# Altium project TS-4900 Yonder Parent.PrjPcb
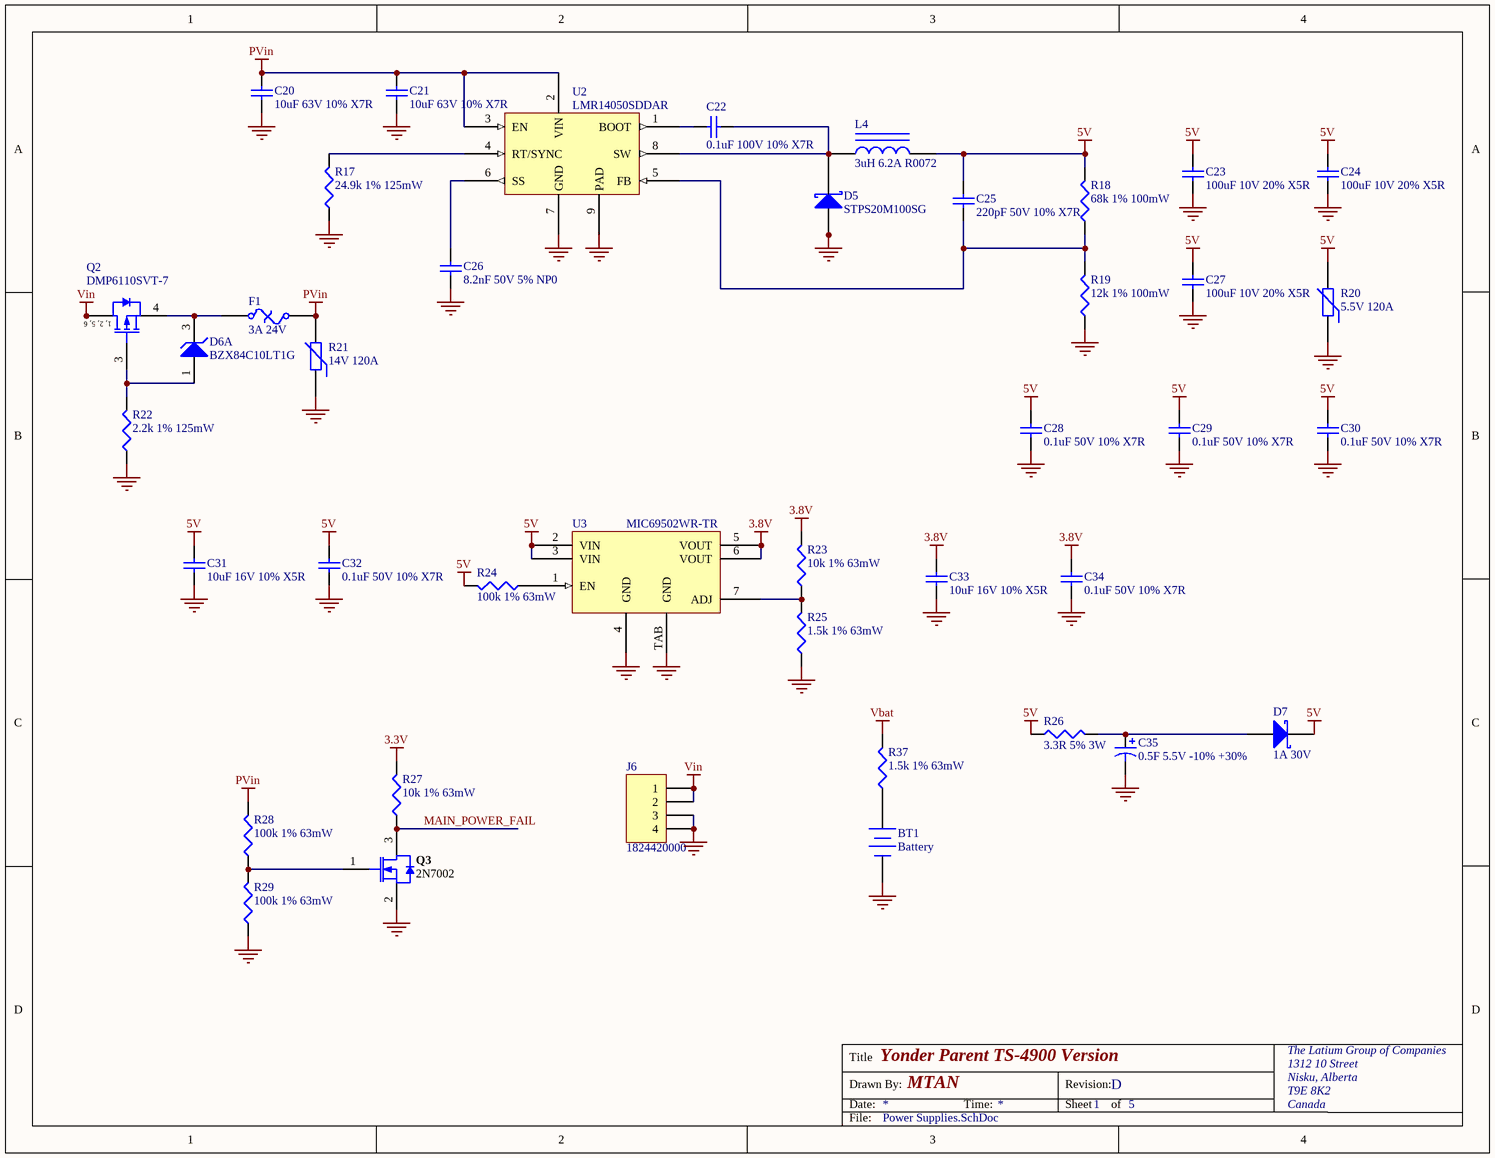
[diagram p0: Power Supplies.SchDoc]
5 sheets, 152 parts. Net scope: global (net labels, ports and power ports of the same name join across sheets).
Board file: TS-4900 Yonder Parent.PcbDoc
Sheets:
  Power Supplies.SchDoc
  PCIe Cell Modem.SchDoc
  LoRa Concentrator.SchDoc
  TS-4900 Headers.SchDoc
  External ADC and Reference.SchDoc

## Sheet Power Supplies.SchDoc: Yonder Parent TS-4900 Version
size Letter; DrawnBy: MTAN; Organization: Altium Limited; DocumentNumber: 1; Revision: D; SheetNumber: 1; SheetTotal: 5

### Parts
BT1  Battery  [MPD BS-7]
C20  10uF 63V 10% X7R  [C1210_L]
C21  10uF 63V 10% X7R  [C1210_L]
C22  0.1uF 100V 10% X7R  [C0805]
C23  100uF 10V 20% X5R  [C1210_L]
C24  100uF 10V 20% X5R  [C1210_L]
C25  220pF 50V 10% X7R  [1608[0603]]
C26  8.2nF 50V 5% NP0  [1608[0603]]
C27  100uF 10V 20% X5R  [C1210_L]
C28  0.1uF 50V 10% X7R  [CAPC1005L]
C29  0.1uF 50V 10% X7R  [CAPC1005L]
C30  0.1uF 50V 10% X7R  [CAPC1005L]
C31  10uF 16V 10% X5R  [C0805]
C32  0.1uF 50V 10% X7R  [CAPC1005L]
C33  10uF 16V 10% X5R  [C0805]
C34  0.1uF 50V 10% X7R  [CAPC1005L]
C35  0.5F 5.5V -10% +30%  [Illinois SuperCap]
D5  STPS20M100SG  [ONSC-D2PAK-3-418AJ_A_V]
D6  BZX84C10LT1G  [SOT23-3_L]  (part A of 2)
D7  1A 30V  [SOD323]
F1  3A 24V  [2920]
J6  1824420000  [1824420000]
L4  3uH 6.2A R0072  [SRU1048]
Q2  DMP6110SVT-7  [SOT23-6_L]
Q3  2N7002  [INF-PG-SOT23_L]
R17  24.9k 1% 125mW  [6-0805_L]
R18  68k 1% 100mW  [J1-0603]
R19  12k 1% 100mW  [J1-0603]
R20  5.5V 120A  [6-0805_L]
R21  14V 120A  [6-0805_L]
R22  2.2k 1% 125mW  [6-0805_L]
R23  10k 1% 63mW  [RESC1005L]
R24  100k 1% 63mW  [RESC1005L]
R25  1.5k 1% 63mW  [RESC1005L]
R26  3.3R 5% 3W  [RESC6432AL]
R27  10k 1% 63mW  [RESC1005L]
R28  100k 1% 63mW  [RESC1005L]
R29  100k 1% 63mW  [RESC1005L]
R37  1.5k 1% 63mW  [RESC1005L]
U2  LMR14050SDDAR  [MRA08A_L]
U3  MIC69502WR-TR  [SPak-7]

### Nets
3.3V: R27.2
3.8V: C33.1 C34.1 R23.2 U3.5(VOUT) U3.6(VOUT)
5V: C23.2 C24.2 C25.2 C27.2 C28.1 C29.1 C30.1 C31.1 C32.1 D7.1(K) L4.2 R18.2 R20.2 R24.2 R26.1 U3.2(VIN) U3.3(VIN)
GND: BT1.2(-) C20.1 C21.1 C23.1 C24.1 C26.1 C27.1 C28.2 C29.2 C30.2 C31.2 C32.2 C33.2 C34.2 C35.2 D5.1(A) D5.3(A) J6.3 J6.4 Q3.2(SOURCE) R17.1 R19.1 R20.1 R21.1 R22.1 R25.1 R29.1 U2.7(GND) U2.9(PAD) U3.4(GND) U3.TAB(GND)
PVin: C20.2 C21.2 F1.2 R21.2 R28.2 U2.2(VIN) U2.3(EN)
Vbat: R37.2
Vin: J6.1 J6.2 Q2.1(D) Q2.2(D) Q2.5(D) Q2.6(D)
MAIN_POWER_FAIL: Q3.3(DRAIN) R27.1
NetBT1_1: BT1.1(+) R37.1
NetC22_1: C22.1 D5.4(K) L4.1 U2.8(SW)
NetC22_2: C22.2 U2.1(BOOT)
NetC25_1: C25.1 R18.1 R19.2 U2.5(FB)
NetC26_2: C26.2 U2.6(SS)
NetC35_1: C35.1 D7.2(A) R26.2
NetD6_1: D6.1(A) Q2.3(G) R22.2
NetD6_3: D6.3(K) F1.1 Q2.4(S)
NetQ3_1: Q3.1(GATE) R28.1 R29.2
NetR17_2: R17.2 U2.4(RT/SYNC)
NetR23_1: R23.1 R25.2 U3.7(ADJ)
NetR24_1: R24.1 U3.1(EN)

### Notes on the sheet
- Title
- Drawn By:
- Date:
- Time:
- Revision:
- Sheet
- of
- The Latium Group of Companies
- 1312 10 Street
- Nisku, Alberta
- T9E 8K2
- Canada
- File:
- (in symbol NTGS3136PT1G) 1, 2, 5, 6

### Library data of the parts
BT1 = Battery: BATTERY HOLDER COIN 20MM PC PIN; Manufacturer: MPD (Memory Protection Devices); Manufacturer Part Number: BS-7; Value: CR2032 Coin Cell Holder; Supplier 1: Digi-Key; Supplier 1 Part Number: BS-7-ND
C20-C34 = Cap: Capacitor
  C20 C21: Value: 10uF 63V 10% X7R
  C22: Value: 0.1uF 100V 10% X7R
  C23 C24 C27: Value: 100uF 10V 20% X5R
  C25: Value: 220pF 50V 10% X7R
  C26: Value: 8.2nF 50V 5% NP0
  C28-C30 C32 C34: Value: 0.1uF 50V 10% X7R
  C31 C33: Value: 10uF 16V 10% X5R
C35 = Cap Pol1: CAP 500MF -10% +30% 5.5V TH; Manufacturer: Illinois Capacitor; Manufacturer Part Number: DGH504Q5R5; ComponentLink1Descrption: Data Sheet; Value: 0.5F 5.5V -10% +30%; Supplier 1: Digi-Key; Supplier 1 Part Number: 1572-1776-ND; ComponentLink1URL: S:\Hardware\Data Sheets\Passive\Capacitors\DGH series.pdf
D5 = BAS70: DIODE SCHOTTKY 100V 20A D2PAK; Manufacturer: STMicroelectronics; ComponentLink2Description: Datasheet; ComponentLink2URL: S:\Hardware\Data Sheets\Passive\Diodes\STPS20M100.pdf; Value: STPS20M100SG; Manufacturer Part Number: STPS20M100SG; Supplier 1: Digi-Key; Supplier 1 Part Number: 497-10993-1-ND
D6 = BZX84C10LT1G: DIODE ZENER 10V 225MW SOT23-3; Manufacturer: On Semiconductor; Supplier 1: Digi-Key; Supplier 1 Part Number: BZX84C10LT1GOSCT-ND; ComponentLink1Description: Data Sheet; ComponentLink1URL: S:\Hardware\Data Sheets\Passive\Diodes\BZX84C2V4LT1-D.pdf; Value: BZX84C10LT1G; Manufacturer Part Number: BZX84C10LT1G
D7 = D Schottky: Schottky Diode; Manufacturer: Toshiba Semiconductor and Storage; Manufacturer Part Number: CUS10S30,H3F; Value: 1A 30V; Supplier 1: Digi-Key; Supplier 1 Part Number: CUS10S30H3FCT-ND
F1 = Fuse Thermal: Thermal Fuse; Manufacturer Part Number: SMDC300F/24-2; Manufacturer: Littelfuse Inc; Value: 3A 24V; Supplier 1: Digi-Key; Supplier 1 Part Number: SMDC300F/24-2CT-ND
J6 = Header 4H: TERM BLK 2POS SIDE ENT 3.5MM PCB; Manufacturer: Weidmuller; Value: 1824420000; Manufacturer Part Number: 1824420000; Supplier 1: Digi-Key; Supplier 1 Part Number: 281-2020-ND
L4 = Inductor Iron: FIXED IND 3UH 6.2A 7.2 MOHM SMD; Manufacturer Part Number: SRU1048-3R0Y; Manufacturer: Bourns Inc; Value: 3uH 6.2A R0072; Supplier 1: Digi-Key; Supplier 1 Part Number: SRU1048-3R0YCT-ND; ComponentLink1Description: Data Sheet; ComponentLink1URL: S:\Hardware\Data Sheets\Passive\Inductors\SRU1048.pdf
Q2 = NTGS3136PT1G: MOSFET P-CH 60V TSOT26; Manufacturer: Diodes Incorporated; ComponentLink1Description: Data Sheet; ComponentLink1URL: S:\Hardware\Data Sheets\Passive\FETs\DMP6110SVT.pdf; Value: DMP6110SVT-7; Manufacturer Part Number: DMP6110SVT-7; Supplier 1: Digi-Key; Supplier 1 Part Number: DMP6110SVT-7DICT-ND
Q3 = 2N7002: MOSFET N-CH 60V 115MA SOT-23; Manufacturer: ON Semiconductor; PartNumber: 2N7002; ComponentLink1Description: Data Sheet; ComponentLink1URL: S:\Hardware\Data Sheets\Active\Transistors\FETs\NDS7002A-D.pdf; Manufacturer Part Number: 2N7002; Value: 2N7002; Supplier 1: Digi-Key; Supplier 1 Part Number: 2N7002NCT-ND
R17-R19 R22-R25 R27-R29 R37 = Res3: Resistor
  R17: Value: 24.9k 1% 125mW
  R18: Value: 68k 1% 100mW
  R19: Value: 12k 1% 100mW
  R22: Value: 2.2k 1% 125mW
  R23 R27: Value: 10k 1% 63mW
  R24 R28 R29: Value: 100k 1% 63mW
  R25 R37: Value: 1.5k 1% 63mW
R20 = Res Varistor: VARISTOR 8.2V 120A 0805; Manufacturer: Littelfuse Inc; Manufacturer Part Number: V5.5MLA0805H; Value: 5.5V 120A; Supplier 1: Digi-Key; Supplier 1 Part Number: F2215CT-ND
R21 = Res Varistor: VARISTOR 18.1V 120A 0805; Manufacturer: Littelfuse Inc; Manufacturer Part Number: V14MLA0805NH; Value: 14V 120A; Supplier 1: Digi-Key; Supplier 1 Part Number: F3734CT-ND
R26 = Res3: RES SMD 3.3 OHM 5% 3W 2512; Manufacturer: TE Connectivity Passive Product; Manufacturer Part Number: 35223R3JT; Value: 3.3R 5% 3W; Supplier 1: Digi-Key; Supplier 1 Part Number: A121247CT-ND
U2 = LMR14050: IC REG BUCK ADJUSTABLE 5A 8SOPWR; Manufacturer: Texas Instruments; Value: LMR14050SDDAR; Manufacturer Part Number: LMR14050SDDAR; Supplier 1: Digi-Key; Supplier 1 Part Number: 296-44322-1-ND; ComponentLink1Description: Data Sheet; ComponentLink1URL: S:\Hardware\Data Sheets\Active\Voltage Regulators\lmr14050.pdf
U3 = MIC69502: IC REG LINEAR POS ADJ 5A SPAK-7; Manufacturer: Microchip Technology; Value: MIC69502WR-TR; Manufacturer Part Number: MIC69502WR-TR; Supplier 1: Digi-Key; Supplier 1 Part Number: MIC69502WR-CT-ND; ComponentLink1Description: Data Sheet; ComponentLink1URL: S:\Hardware\Data Sheets\Active\Voltage Regulators\mic69502.pdf

## Sheet PCIe Cell Modem.SchDoc: Yonder Parent TS-4900 Version
size Letter; DrawnBy: MTAN; Organization: Altium Limited; DocumentNumber: 2; Revision: D; SheetNumber: 2; SheetTotal: 5
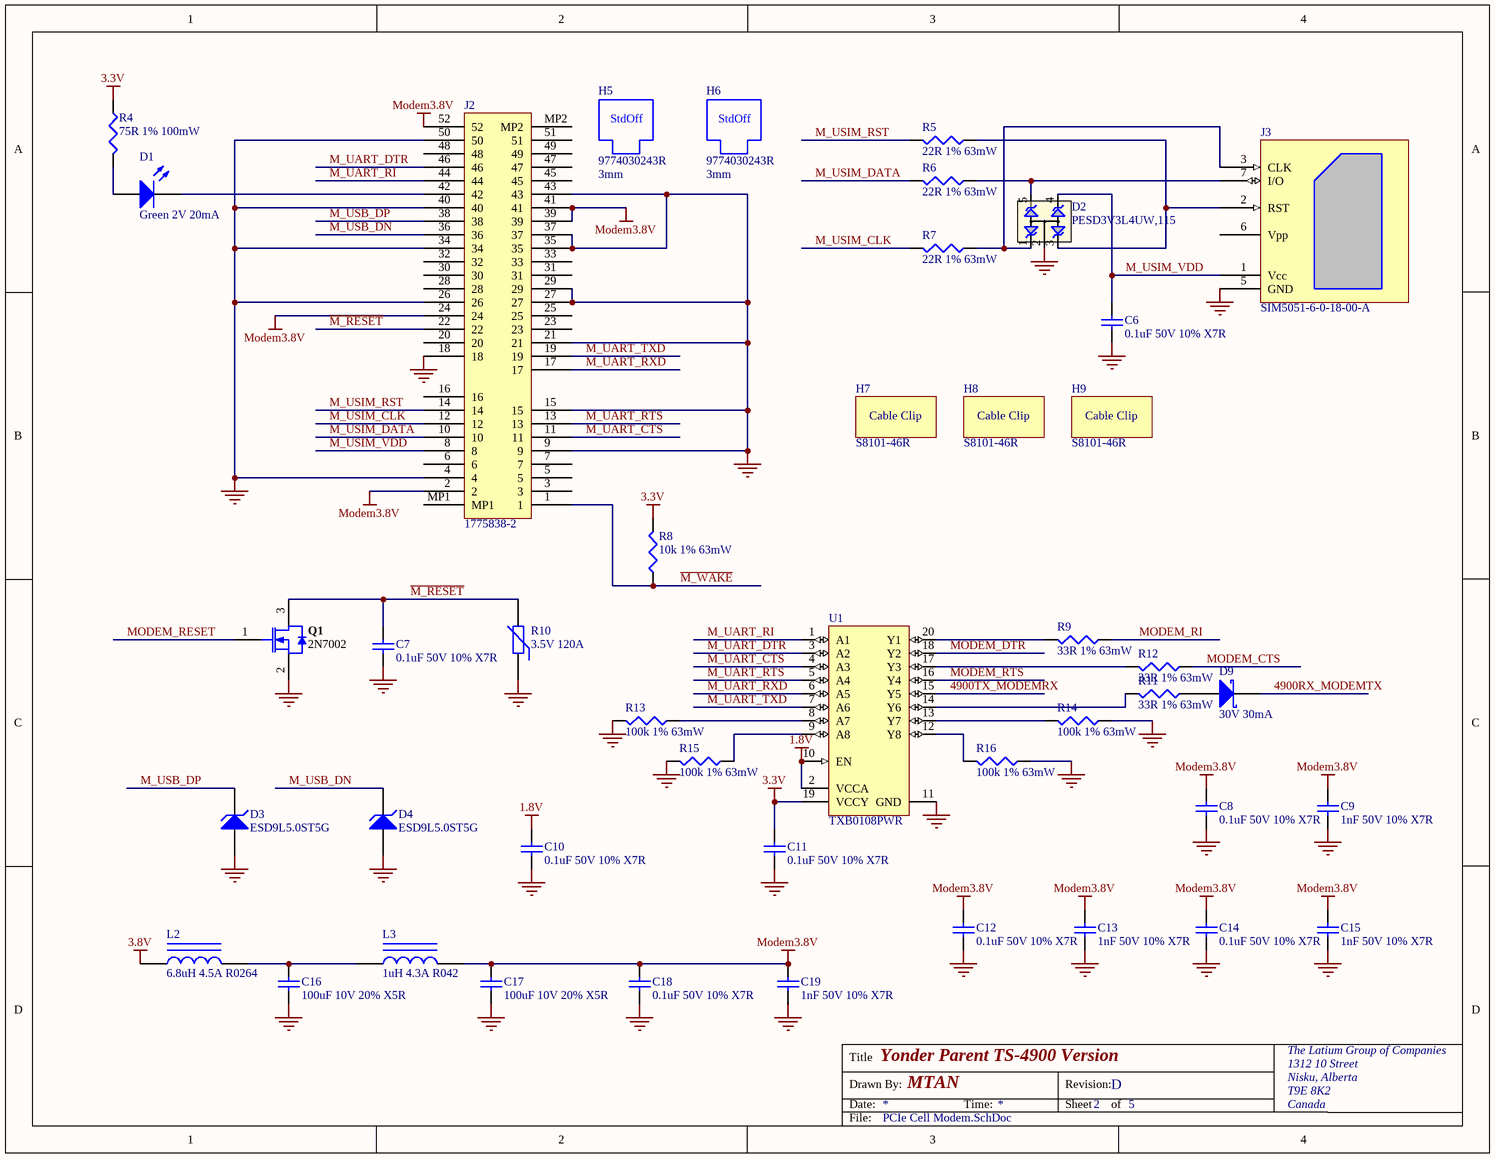
[diagram p1: PCIe Cell Modem.SchDoc]

### Parts
C6  0.1uF 50V 10% X7R  [CAPC1005L]
C7  0.1uF 50V 10% X7R  [CAPC1005L]
C8  0.1uF 50V 10% X7R  [CAPC1005L]
C9  1nF 50V 10% X7R  [CAPC1005L]
C10  0.1uF 50V 10% X7R  [CAPC1005L]
C11  0.1uF 50V 10% X7R  [CAPC1005L]
C12  0.1uF 50V 10% X7R  [CAPC1005L]
C13  1nF 50V 10% X7R  [CAPC1005L]
C14  0.1uF 50V 10% X7R  [CAPC1005L]
C15  1nF 50V 10% X7R  [CAPC1005L]
C16  100uF 10V 20% X5R  [C1210_L]
C17  100uF 10V 20% X5R  [C1210_L]
C18  0.1uF 50V 10% X7R  [CAPC1005L]
C19  1nF 50V 10% X7R  [CAPC1005L]
D1  Green 2V 20mA  [CD1608-0603]
D2  PESD3V3L4UW,115  [SOT-665]
D3  ESD9L5.0ST5G  [SOD-923]
D4  ESD9L5.0ST5G  [SOD-923]
D9  30V 30mA  [CD1310-0504]
H5  9774030243R  Height: 3mm  [Wurth 9774030243R]
H6  9774030243R  Height: 3mm  [Wurth 9774030243R]
H7  S8101-46R  [Coax Cable Clip]
H8  S8101-46R  [Coax Cable Clip]
H9  S8101-46R  [Coax Cable Clip]
J2  1775838-2  [TE 1775838-2]
J3  SIM5051-6-0-18-00-A  [SIM5051-6]
L2  6.8uH 4.5A R0264  [1267AY]
L3  1uH 4.3A R042  [WE-LQS 252012]
Q1  2N7002  [INF-PG-SOT23_L]
R4  75R 1% 100mW  [RESC1608L]
R5  22R 1% 63mW  [RESC1005L]
R6  22R 1% 63mW  [RESC1005L]
R7  22R 1% 63mW  [RESC1005L]
R8  10k 1% 63mW  [RESC1005L]
R9  33R 1% 63mW  [RESC1005L]
R10  3.5V 120A  [6-0805_L]
R11  33R 1% 63mW  [RESC1005L]
R12  33R 1% 63mW  [RESC1005L]
R13  100k 1% 63mW  [RESC1005L]
R14  100k 1% 63mW  [RESC1005L]
R15  100k 1% 63mW  [RESC1005L]
R16  100k 1% 63mW  [RESC1005L]
U1  TXB0108PWR  [TSSOP20_L]

### Nets
1.8V: C10.1 U1.2(VCCA) U1.10(EN)
3.3V: C11.1 R4.1 R8.2 U1.19(VCCY)
3.8V: L2.1
GND: C6.2 C7.2 C8.2 C9.2 C10.2 C11.2 C12.2 C13.2 C14.2 C15.2 C16.1 C17.1 C18.2 C19.2 D2.2(A1) D3.1(A) D4.1(A) J2.4 J2.9 J2.15 J2.18 J2.21 J2.26 J2.27 J2.29 J2.34 J2.35 J2.37 J2.40 J2.43 J2.50 J3.5(GND) Q1.2(SOURCE) R10.1 R13.2 R14.1 R15.2 R16.1 U1.11(GND)
Modem3.8V: C8.1 C9.1 C12.1 C13.1 C14.1 C15.1 C17.2 C18.1 C19.1 J2.2 J2.24 J2.39 J2.41 J2.52 L3.2
4900RX_MODEMTX: D9.2(K)
4900TX_MODEMRX: U1.15(Y5)
~{M_RESET}: C7.1 J2.22 Q1.3(DRAIN) R10.2
~{M_WAKE}: J2.1 R8.1
M_UART_CTS: J2.11 U1.4(A3)
M_UART_DTR: J2.46 U1.3(A2)
M_UART_RI: J2.44 U1.1(A1)
M_UART_RTS: J2.13 U1.5(A4)
M_UART_RXD: J2.17 U1.6(A5)
M_UART_TXD: J2.19 U1.7(A6)
M_USB_DN: D4.2(K) J2.36
M_USB_DP: D3.2(K) J2.38
M_USIM_CLK: J2.12 R7.2
M_USIM_DATA: J2.10 R6.2
M_USIM_RST: J2.14 R5.2
M_USIM_VDD: C6.1 D2.4(C3) J2.8 J3.1(Vcc)
MODEM_CTS: R12.1
MODEM_DTR: U1.18(Y2)
MODEM_RESET: Q1.1(GATE)
MODEM_RI: R9.1
MODEM_RTS: U1.16(Y4)
NetC16_2: C16.2 L2.2 L3.1
NetD1_1: D1.1(A) R4.2
NetD1_2: D1.2(K) J2.42
NetD2_1: D2.1(C1) J3.3(CLK) R7.1
NetD2_3: D2.3(C2) J3.2(RST) R5.1
NetD2_5: D2.5(C4) J3.7(I/O) R6.1
NetD9_1: D9.1(A) R11.1
NetR9_2: R9.2 U1.20(Y1)
NetR11_2: R11.2 U1.14(Y6)
NetR12_2: R12.2 U1.17(Y3)
NetR13_1: R13.1 U1.8(A7)
NetR14_2: R14.2 U1.13(Y7)
NetR15_1: R15.1 U1.9(A8)
NetR16_2: R16.2 U1.12(Y8)

Not connected (* = marked no-connect by the designer): J2 3 5 6 7 16 20 23 25 28 30 31 32 33 45 47 48 49 51 MP1 MP2; J3 6(Vpp)

### Notes on the sheet
- Title
- Drawn By:
- Date:
- Time:
- Revision:
- Sheet
- of
- The Latium Group of Companies
- 1312 10 Street
- Nisku, Alberta
- T9E 8K2
- Canada
- File:
- (in symbol SMD M3 Spacer) StdOff

### Library data of the parts
C6-C19 = Cap: Capacitor
  C6-C8 C10-C12 C14 C18: Value: 0.1uF 50V 10% X7R
  C9 C13 C15 C19: Value: 1nF 50V 10% X7R
  C16 C17: Value: 100uF 10V 20% X5R
D1 = LED2: LED GREEN CLEAR 0603 SMD; Manufacturer: Wurth Electronics Inc; Manufacturer Part Number: 150060VS75000; Value: Green 2V 20mA; Supplier 1: Digi-Key; Supplier 1 Part Number: 732-4980-1-ND
D2 = 82402374: TVS DIODE 3.3V 12V SOT665; Manufacturer: Nexperia USA Inc; Value: PESD3V3L4UW,115; Manufacturer Part Number: PESD3V3L4UW,115; Supplier 1: Digi-Key; Supplier 1 Part Number: 1727-5790-1-ND; ComponentLink1Description: Data Sheet; ComponentLink1URL: S:\Hardware\Data Sheets\Passive\TVS\PESDXL4UF_G_W.pdf
D3 D4 = D Zener: TVS DIODE 5V 9.8V SOD923; Manufacturer: ON Semiconductor; Value: ESD9L5.0ST5G; Manufacturer Part Number: ESD9L5.0ST5G; Supplier 1: Digi-Key; Supplier 1 Part Number: ESD9L5.0ST5GOSCT-ND
D9 = D Schottky: DIODE SCHOTTKY 30V 30MA SOD523; Manufacturer: ON Semiconductor; Manufacturer Part Number: RB751S40T1G; Value: 30V 30mA; Supplier 1: Digi-Key; Supplier 1 Part Number: RB751S40T1GOSCT-ND
H5 H6 = SMD M3 Spacer: ROUND STANDOFF M2X0.4 STEEL 3MM; Manufacturer: Wurth Electronics Inc; Supplier 1: Digi-Key; Value: 9774030243R; Manufacturer Part Number: 9774030243R; ComponentLink1Description: Drawing; ComponentLink1URL: S:\Hardware\Data Sheets\Passive\Standoffs\Wurth 9774070360R.pdf; Supplier 1 Part Number: 732-7085-1-ND
H7-H9 = Cable Clip: CBL CLIP C-TYPE SILVER SOLDER; Manufacturer: Harwin Inc; Value: S8101-46R; ComponentLink1Description: Drawing; ComponentLink1URL: S:\Hardware\Data Sheets\Passive\Strain Reliefs\S8101R.pdf; Manufacturer Part Number: S8101-46R; Supplier 1: Digi-Key; Supplier 1 Part Number: 952-1576-1-ND
J2 = TE1775838-2: CONN PCI EXP MINI FEMALE 52POS; Manufacturer: TE Connectivity AMP Connectors; Value: 1775838-2; Manufacturer Part Number: 1775838-2; ComponentLink1Description: Data Sheet; ComponentLink1URL: S:\Hardware\Data Sheets\Passive\Connectors\TE Mini PCIe 52 Pin Connector.pdf; Supplier 1: Digi-Key; Supplier 1 Part Number: A123340CT-ND; ComponentLink2Description: SIM7600 PCIe HW Design Guide; ComponentLink2URL: S:\Hardware\Data Sheets\Active\Modems\SIM7600 PCIe Hardware Design Guide.pdf
J3 = Mini SIM 6pos Conn: MINI SIM HINGED, 6P, SMT, 1.8MM; Manufacturer: GCT; Value: SIM5051-6-0-18-00-A; Manufacturer Part Number: SIM5051-6-0-18-00-A; Supplier 1: Digi-Key; Supplier 1 Part Number: 2073-SIM5051-6-0-18-00-ACT-ND; ComponentLink1Description: Data Sheet; ComponentLink1URL: S:\Hardware\Data Sheets\Passive\Connectors\sim5051.pdf
L2 = Inductor Iron: 6.8µH Shielded Fixed Inductor; Manufacturer Part Number: 1267AY-6R8N=P3; Manufacturer: Murata Electronics; Value: 6.8uH 4.5A R0264; Supplier 1: Digi-Key; Supplier 1 Part Number: 490-14066-1-ND
L3 = Inductor Iron: FIXED IND 1UH 4.3A 42 MOHM SMD; Manufacturer Part Number: DFE252012P-1R0M=P2; Manufacturer: Murata Electronics; Value: 1uH 4.3A R042; Supplier 1: Digi-Key; Supplier 1 Part Number: 490-10647-1-ND
Q1 = 2N7002: as Q3 on sheet Power Supplies; PartNumber: 2N7002; ComponentLink1Description: Data Sheet; ComponentLink1URL: S:\Hardware\Data Sheets\Active\Transistors\FETs\NDS7002A-D.pdf; Manufacturer Part Number: 2N7002; Value: 2N7002; Supplier 1: Digi-Key; Supplier 1 Part Number: 2N7002NCT-ND
R4-R9 R11-R16 = Res3: Resistor
  R4: Value: 75R 1% 100mW
  R5-R7: Value: 22R 1% 63mW
  R8: Value: 10k 1% 63mW
  R9 R11 R12: Value: 33R 1% 63mW
  R13-R16: Value: 100k 1% 63mW
R10 = Res Varistor: VARISTOR 5.35V 120A 0805; Manufacturer: Littelfuse Inc; Manufacturer Part Number: V3.5MLA0805H; Value: 3.5V 120A; Supplier 1: Digi-Key; Supplier 1 Part Number: F2206CT-ND
U1 = ADG3300BRUZ: IC TRNSLTR BIDIRECTIONAL 20TSSOP; Manufacturer: Texas Instruments; Value: TXB0108PWR; Manufacturer Part Number: TXB0108PWR; Supplier 1: Digi-Key; Supplier 1 Part Number: 296-21527-1-ND; ComponentLink1Description: Data Sheet; ComponentLink1URL: S:\Hardware\Data Sheets\Active\Logic\txb0108.pdf

## Sheet LoRa Concentrator.SchDoc: Yonder Parent TS-4900 Version
size Letter; DrawnBy: MTAN; Organization: Altium Limited; DocumentNumber: 3; Revision: D; SheetNumber: 3; SheetTotal: 5
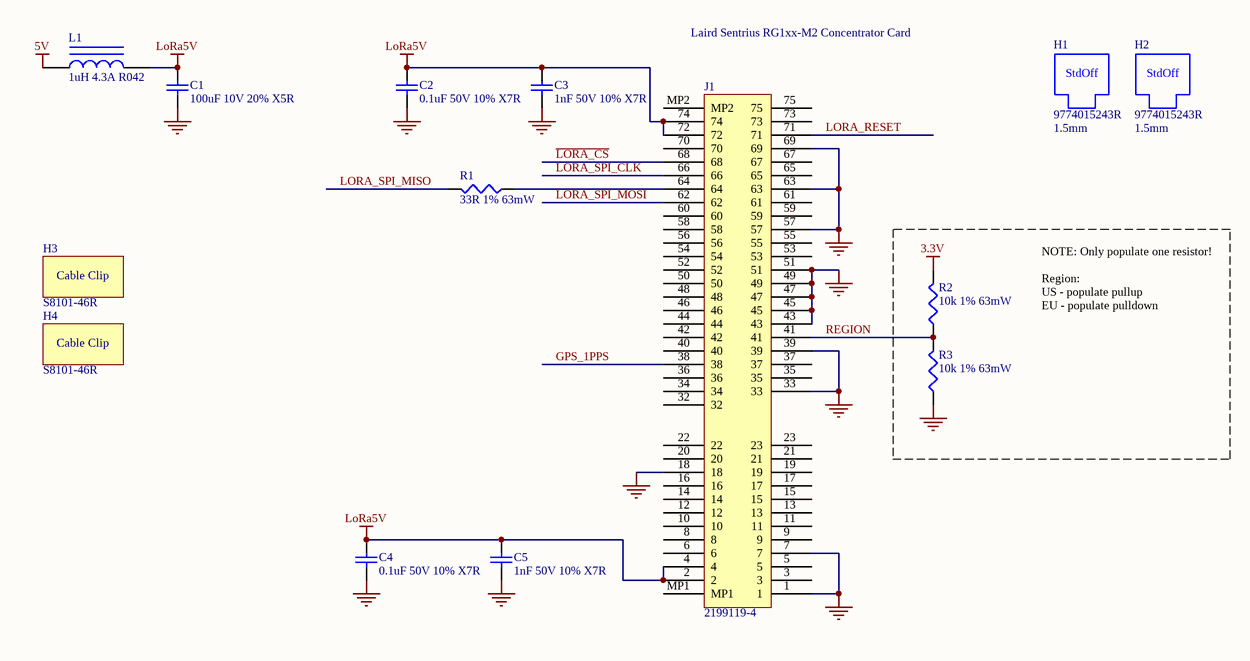
[diagram p2: LoRa Concentrator.SchDoc]

### Parts
C1  100uF 10V 20% X5R  [C1210_L]
C2  0.1uF 50V 10% X7R  [CAPC1005L]
C3  1nF 50V 10% X7R  [CAPC1005L]
C4  0.1uF 50V 10% X7R  [CAPC1005L]
C5  1nF 50V 10% X7R  [CAPC1005L]
H1  9774015243R  Height: 1.5mm  [Wurth 9774015243R]
H2  9774015243R  Height: 1.5mm  [Wurth 9774015243R]
H3  S8101-46R  [Coax Cable Clip]
H4  S8101-46R  [Coax Cable Clip]
J1  2199119-4  [TE 2199119-4]
L1  1uH 4.3A R042  [WE-LQS 252012]
R1  33R 1% 63mW  [RESC1005L]
R2  10k 1% 63mW  [RESC1005L]
R3  10k 1% 63mW  [RESC1005L]

### Nets
3.3V: R2.2
5V: L1.1
GND: C1.1 C2.2 C3.2 C4.2 C5.2 J1.1 J1.7 J1.18 J1.33 J1.39 J1.43 J1.45 J1.47 J1.49 J1.51 J1.57 J1.63 J1.69 R3.1
LoRa5V: C1.2 C2.1 C3.1 C4.1 C5.1 J1.2 J1.4 J1.72 J1.74 L1.2
GPS_1PPS: J1.38
~{LORA_CS}: J1.68
LORA_RESET: J1.71
LORA_SPI_CLK: J1.66
LORA_SPI_MISO: R1.2
LORA_SPI_MOSI: J1.62
REGION: J1.41 R2.1 R3.2
NetJ1_64: J1.64 R1.1

Not connected (* = marked no-connect by the designer): J1 3 5 6 8 9 10 11 12 13 14 15 16 17 19 20 21 22 23 32 34 35 36 37 40 42 44 46 48 50 52 53 54 55 56 58 59 60 61 65 67 70 73 75 MP1 MP2

### Notes on the sheet
- Laird Sentrius RG1xx-M2 Concentrator Card
- NOTE: Only populate one resistor!
  Region:
  US - populate pullup
  EU - populate pulldown
- Title
- Drawn By:
- Date:
- Time:
- Revision:
- Sheet
- of
- The Latium Group of Companies
- 1312 10 Street
- Nisku, Alberta
- T9E 8K2
- Canada
- File:
- (in symbol SMD 1.5mm Spacer) StdOff

### Library data of the parts
C1-C5 = Cap: Capacitor
  C1: Value: 100uF 10V 20% X5R
  C2 C4: Value: 0.1uF 50V 10% X7R
  C3 C5: Value: 1nF 50V 10% X7R
H1 H2 = SMD 1.5mm Spacer: RND STANDOFF M2X0.4 STEEL; Manufacturer: Wurth Electronics Inc; Supplier 1: Digi-Key; Value: 9774015243R; Manufacturer Part Number: 9774015243R; Supplier 1 Part Number: 732-7069-1-ND; ComponentLink1Description: Drawing; ComponentLink1URL: S:\Hardware\Data Sheets\Passive\Standoffs\Wurth 9774015243R.pdf
H3 H4 = Cable Clip: as H7 on sheet PCIe Cell Modem; Value: S8101-46R; ComponentLink1Description: Drawing; ComponentLink1URL: S:\Hardware\Data Sheets\Passive\Strain Reliefs\S8101R.pdf; Manufacturer Part Number: S8101-46R; Supplier 1: Digi-Key; Supplier 1 Part Number: 952-1576-1-ND
J1 = TE2199119-4: CONN FEMALE 67POS 0.020 GOLD; Manufacturer: TE Connectivity AMP Connectors; Value: 2199119-4; Manufacturer Part Number: 2199119-4; ComponentLink1Description: Data Sheet; ComponentLink1URL: S:\Hardware\Data Sheets\Passive\Connectors\TE NGFF M2 Connector.pdf; Supplier 1: Digi-Key; Supplier 1 Part Number: A115900CT-ND
L1 = Inductor Iron: as L3 on sheet PCIe Cell Modem; Value: 1uH 4.3A R042; Supplier 1: Digi-Key; Supplier 1 Part Number: 490-10647-1-ND
R1-R3 = Res3: Resistor
  R1: Value: 33R 1% 63mW
  R2 R3: Value: 10k 1% 63mW

## Sheet TS-4900 Headers.SchDoc: Yonder Parent TS-4900 Version
size Letter; DrawnBy: MTAN; Organization: Altium Limited; DocumentNumber: 4; Revision: D; SheetNumber: 4; SheetTotal: 5
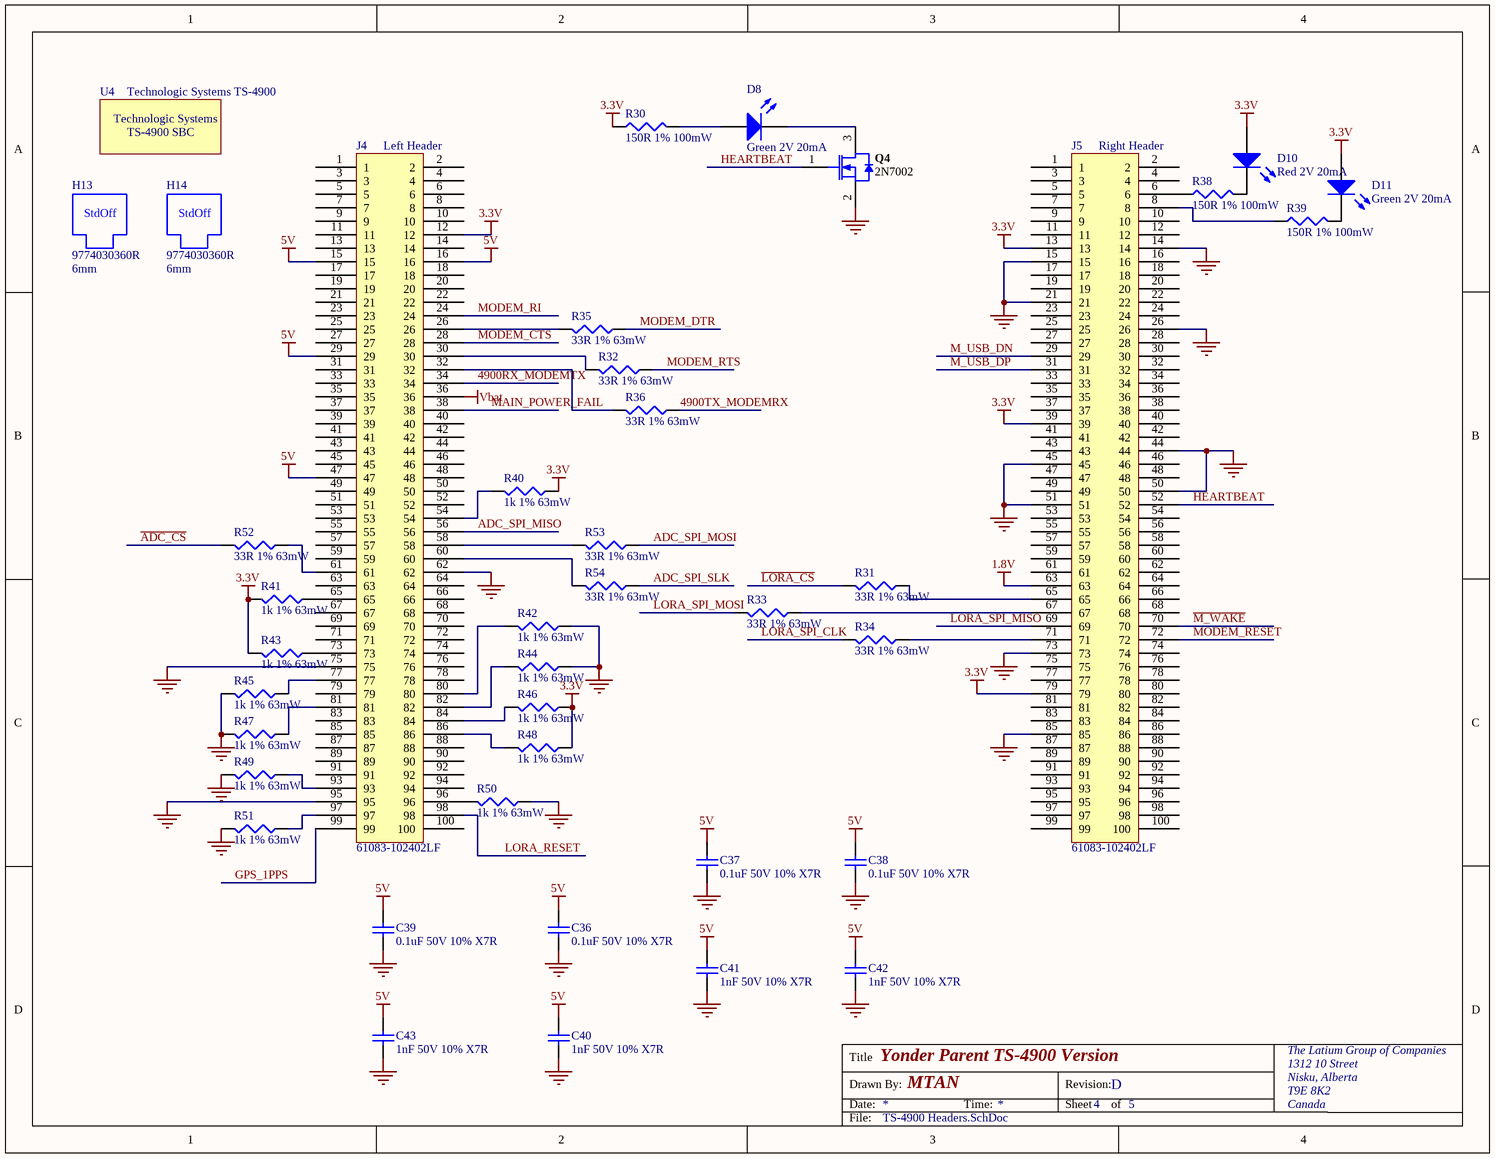
[diagram p3: TS-4900 Headers.SchDoc]

### Parts
C36  0.1uF 50V 10% X7R  [CAPC1005L]
C37  0.1uF 50V 10% X7R  [CAPC1005L]
C38  0.1uF 50V 10% X7R  [CAPC1005L]
C39  0.1uF 50V 10% X7R  [CAPC1005L]
C40  1nF 50V 10% X7R  [CAPC1005L]
C41  1nF 50V 10% X7R  [CAPC1005L]
C42  1nF 50V 10% X7R  [CAPC1005L]
C43  1nF 50V 10% X7R  [CAPC1005L]
D8  Green 2V 20mA  [CD1608-0603]
D10  Red 2V 20mA  [CD1608-0603]
D11  Green 2V 20mA  [CD1608-0603]
H13  9774030360R  Height: 6mm  [Wurth 9774060360R]
H14  9774030360R  Height: 6mm  [Wurth 9774060360R]
J4  61083-102402LF  Note: Left Header  [TS 100 Pin Header]
J5  61083-102402LF  Note: Right Header  [TS 100 Pin Header]
Q4  2N7002  [INF-PG-SOT23_L]
R30  150R 1% 100mW  [RESC1608L]
R31  33R 1% 63mW  [RESC1005L]
R32  33R 1% 63mW  [RESC1005L]
R33  33R 1% 63mW  [RESC1005L]
R34  33R 1% 63mW  [RESC1005L]
R35  33R 1% 63mW  [RESC1005L]
R36  33R 1% 63mW  [RESC1005L]
R38  150R 1% 100mW  [RESC1608L]
R39  150R 1% 100mW  [RESC1608L]
R40  1k 1% 63mW  [RESC1005L]
R41  1k 1% 63mW  [RESC1005L]
R42  1k 1% 63mW  [RESC1005L]
R43  1k 1% 63mW  [RESC1005L]
R44  1k 1% 63mW  [RESC1005L]
R45  1k 1% 63mW  [RESC1005L]
R46  1k 1% 63mW  [RESC1005L]
R47  1k 1% 63mW  [RESC1005L]
R48  1k 1% 63mW  [RESC1005L]
R49  1k 1% 63mW  [RESC1005L]
R50  1k 1% 63mW  [RESC1005L]
R51  1k 1% 63mW  [RESC1005L]
R52  33R 1% 63mW  [RESC1005L]
R53  33R 1% 63mW  [RESC1005L]
R54  33R 1% 63mW  [RESC1005L]
U4  Technologic Systems TS-4900  [TS-4900]

### Nets
1.8V: J5.63
3.3V: D10.1(A) D11.1(A) J4.12 J5.13 J5.39 J5.79 R30.1 R40.1 R41.2 R43.2 R46.1 R48.1
5V: C36.1 C37.1 C38.1 C39.1 C40.1 C41.1 C42.1 C43.1 J4.15 J4.16 J4.29 J4.47
GND: C36.2 C37.2 C38.2 C39.2 C40.2 C41.2 C42.2 C43.2 J4.62 J4.75 J4.95 J5.14 J5.15 J5.21 J5.26 J5.44 J5.45 J5.50 J5.51 J5.73 J5.85 Q4.2(SOURCE) R42.1 R44.1 R45.2 R47.2 R49.2 R50.1 R51.2
Vbat: J4.36
4900RX_MODEMTX: J4.34
4900TX_MODEMRX: R36.1
~{ADC_CS}: R52.2
ADC_SPI_MISO: J4.56
ADC_SPI_MOSI: R53.1
ADC_SPI_SLK: R54.1
GPS_1PPS: J4.99
HEARTBEAT: J5.52 Q4.1(GATE)
~{LORA_CS}: R31.2
LORA_RESET: J4.98
LORA_SPI_CLK: R34.2
LORA_SPI_MISO: J5.69
LORA_SPI_MOSI: R33.2
~{M_WAKE}: J5.70
M_USB_DN: J5.29
M_USB_DP: J5.31
MAIN_POWER_FAIL: J4.38
MODEM_CTS: J4.28
MODEM_DTR: R35.1
MODEM_RESET: J5.72
MODEM_RI: J4.24
MODEM_RTS: R32.1
NetD8_1: D8.1(A) R30.2
NetD8_2: D8.2(K) Q4.3(DRAIN)
NetD10_2: D10.2(K) R38.2
NetD11_2: D11.2(K) R39.2
NetJ4_26: J4.26 R35.2
NetJ4_30: J4.30 R32.2
NetJ4_32: J4.32 R36.2
NetJ4_54: J4.54 R40.2
NetJ4_58: J4.58 R53.2
NetJ4_60: J4.60 R54.2
NetJ4_61: J4.61 R52.1
NetJ4_65: J4.65 R41.1
NetJ4_73: J4.73 R43.1
NetJ4_77: J4.77 R45.1
NetJ4_80: J4.80 R42.2
NetJ4_81: J4.81 R47.1
NetJ4_82: J4.82 R44.2
NetJ4_84: J4.84 R46.2
NetJ4_86: J4.86 R48.2
NetJ4_93: J4.93 R49.1
NetJ4_96: J4.96 R50.2
NetJ4_97: J4.97 R51.1
NetJ5_6: J5.6 R38.1
NetJ5_8: J5.8 R39.1
NetJ5_65: J5.65 R31.1
NetJ5_67: J5.67 R33.1
NetJ5_71: J5.71 R34.1

Not connected (* = marked no-connect by the designer): J4 1 2 3 4 5 6 7 8 9 10 11 13 14 17 18 19 20 21 22 23 25 27 31 33 35 37 39 40 41 42 43 44 45 46 48 49 50 51 52 53 55 57 59 63 64 66 67 68 69 70 71 72 74 76 78 79 83 85 87 88 89 90 91 92 94 100; J5 1 2 3 4 5 7 9 10 11 12 16 17 18 19 20 22 23 24 25 27 28 30 32 33 34 35 36 37 38 40 41 42 43 46 47 48 49 53 54 55 56 57 58 59 60 61 62 64 66 68 74 75 76 77 78 80 81 82 83 84 86 87 88 89 90 91 92 93 94 95 96 97 98 99 100

### Notes on the sheet
- Title
- Drawn By:
- Date:
- Time:
- Revision:
- Sheet
- of
- The Latium Group of Companies
- 1312 10 Street
- Nisku, Alberta
- T9E 8K2
- Canada
- File:
- (in symbol SMD M3 Spacer) StdOff
- (in symbol TS-4900) Technologic Systems; TS-4900 SBC

### Library data of the parts
C36-C43 = Cap: Capacitor
  C36-C39: Value: 0.1uF 50V 10% X7R
  C40-C43: Value: 1nF 50V 10% X7R
D8 D11 = LED2: as D1 on sheet PCIe Cell Modem; Value: Green 2V 20mA; Supplier 1: Digi-Key; Supplier 1 Part Number: 732-4980-1-ND
D10 = LED2: LED RED CLEAR 0603 SMD; Manufacturer: Wurth Electronics Inc; Manufacturer Part Number: 150060RS75000; Value: Red 2V 20mA; Supplier 1: Digi-Key; Supplier 1 Part Number: 732-4978-1-ND
H13 H14 = SMD M3 Spacer: ROUND STANDOFF M3X0.5 STEEL 6MM; Manufacturer: Wurth Electronics Inc; Manufacturer Part Number: 9774060360R; Supplier 1: Digi-Key; Value: 9774030360R; ComponentLink1Description: Drawing; ComponentLink1URL: S:\Hardware\Data Sheets\Passive\Spacers\Wurth 9774060360R.pdf; Supplier 1 Part Number: 732-5273-1-ND
J4 J5 = Header 50 x 2: CONN PLUG 100POS SMD GOLD; Manufacturer: Amphenol ICC (FCI); Value: 61083-102402LF; Manufacturer Part Number: 61083-102402LF; Supplier 1: Digi-Key; Supplier 1 Part Number: 609-1693-1-ND; ComponentLink1Description: Drawing 1; ComponentLink1URL: S:\Hardware\Data Sheets\Passive\Connectors\61083.pdf; ComponentLink2URL: S:\Hardware\Data Sheets\Passive\Connectors\cn-tssocket-m-spec.pdf; ComponentLink2Description: Drawing 2
Q4 = 2N7002: as Q3 on sheet Power Supplies; PartNumber: 2N7002; ComponentLink1Description: Data Sheet; ComponentLink1URL: S:\Hardware\Data Sheets\Active\Transistors\FETs\NDS7002A-D.pdf; Manufacturer Part Number: 2N7002; Value: 2N7002; Supplier 1: Digi-Key; Supplier 1 Part Number: 2N7002NCT-ND
R30-R36 R38-R54 = Res3: Resistor
  R30 R38 R39: Value: 150R 1% 100mW
  R31-R36 R52-R54: Value: 33R 1% 63mW
  R40-R51: Value: 1k 1% 63mW
U4 = TS-4900: Value: Technologic Systems TS-4900

## Sheet External ADC and Reference.SchDoc: Yonder Parent TS-4900 Version
size Letter; DrawnBy: MTAN; Organization: Altium Limited; DocumentNumber: 5; Revision: D; SheetNumber: 5; SheetTotal: 5
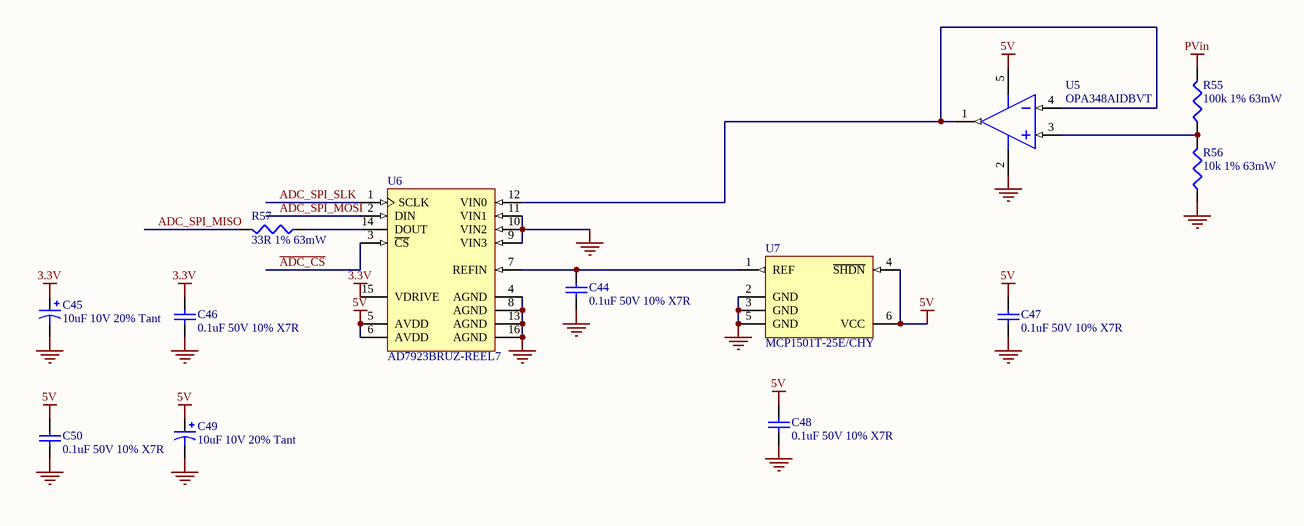
[diagram p4: External ADC and Reference.SchDoc]

### Parts
C44  0.1uF 50V 10% X7R  [CAPC1005L]
C45  10uF 10V 20% Tant  [C0805]
C46  0.1uF 50V 10% X7R  [CAPC1005L]
C47  0.1uF 50V 10% X7R  [CAPC1005L]
C48  0.1uF 50V 10% X7R  [CAPC1005L]
C49  10uF 10V 20% Tant  [C0805]
C50  0.1uF 50V 10% X7R  [CAPC1005L]
R55  100k 1% 63mW  [RESC1005L]
R56  10k 1% 63mW  [RESC1005L]
R57  33R 1% 63mW  [RESC1005L]
U5  OPA348AIDBVT  [TI-DBV5_L]
U6  AD7923BRUZ-REEL7  [RU-16_L]
U7  MCP1501T-25E/CHY  [SOT23-6_L]

### Nets
3.3V: C45.1 C46.1 U6.15(VDRIVE)
5V: C47.1 C48.1 C49.1 C50.1 U5.5(V+) U6.5(AVDD) U6.6(AVDD) U7.4(~{SHDN}) U7.6(VCC)
GND: C44.2 C45.2 C46.2 C47.2 C48.2 C49.2 C50.2 R56.1 U5.2(V-) U6.4(AGND) U6.8(AGND) U6.9(VIN3) U6.10(VIN2) U6.11(VIN1) U6.13(AGND) U6.16(AGND) U7.2(GND) U7.3(GND) U7.5(GND)
PVin: R55.2
~{ADC_CS}: U6.3(~{CS})
ADC_SPI_MISO: R57.2
ADC_SPI_MOSI: U6.2(DIN)
ADC_SPI_SLK: U6.1(SCLK)
NetC44_1: C44.1 U6.7(REFIN) U7.1(REF)
NetR55_1: R55.1 R56.2 U5.3(IN+)
NetR57_1: R57.1 U6.14(DOUT)
NetU5_1: U5.1(OUT) U5.4(IN-) U6.12(VIN0)

### Notes on the sheet
- Title
- Drawn By:
- Date:
- Time:
- Revision:
- Sheet
- of
- The Latium Group of Companies
- 1312 10 Street
- Nisku, Alberta
- T9E 8K2
- Canada
- File:

### Library data of the parts
C44 C46-C48 C50 = Cap: Capacitor; Value: 0.1uF 50V 10% X7R
C45 C49 = Cap Pol3: CAP TANT 10UF 20% 10V 0805; Manufacturer: AVX Corporation; Manufacturer Part Number: TLJR106M010R3000; Value: 10uF 10V 20% Tant; Supplier 1: Digi-Key; Supplier 1 Part Number: 478-3346-1-ND
R55-R57 = Res3: Resistor
  R55: Value: 100k 1% 63mW
  R56: Value: 10k 1% 63mW
  R57: Value: 33R 1% 63mW
U5 = OPA348AIDBVT: IC OPAMP GP 1 CIRCUIT SOT23-5; Manufacturer: Texas Instruments; ComponentLink1Description: Data Sheet; ComponentLink1URL: S:\Hardware\Data Sheets\Active\Amps\opa2348.pdf; Value: OPA348AIDBVT; Manufacturer Part Number: OPA348AIDBVT; Supplier 1: Digi-Key; Supplier 1 Part Number: 296-12276-1-ND
U6 = AD7923BRUZ-REEL7: IC ADC 12BIT SAR 16TSSOP; Manufacturer: Analog Devices Inc; ComponentLink1Description: Data Sheet; ComponentLink1URL: S:\Hardware\Data Sheets\Active\ADCs\AD7923-1.pdf; Value: AD7923BRUZ-REEL7; Manufacturer Part Number: AD7923BRUZ-REEL7; Supplier 1: Digi-Key; Supplier 1 Part Number: AD7923BRUZ-REEL7CT-ND
U7 = MAX6610AUT+: IC VREF SERIES 0.1% SOT23-6; Manufacturer: Microchip Technology; ComponentLink1Description: Data Sheet; ComponentLink1URL: S:\Hardware\Data Sheets\Active\References\MCP1501.pdf; Value: MCP1501T-25E/CHY; Manufacturer Part Number: MCP1501T-25E/CHY; Supplier 1: Digi-Key; Supplier 1 Part Number: MCP1501T-25E/CHYCT-ND

## Nets that join several sheets
1.8V: PCIe Cell Modem (C10.1 U1.2 U1.10), TS-4900 Headers (J5.63)
3.3V: Power Supplies (R27.2), PCIe Cell Modem (C11.1 R4.1 R8.2 U1.19), LoRa Concentrator (R2.2), TS-4900 Headers (12 pins), External ADC and Reference (C45.1 C46.1 U6.15)
3.8V: Power Supplies (5 pins), PCIe Cell Modem (L2.1)
5V: Power Supplies (17 pins), LoRa Concentrator (L1.1), TS-4900 Headers (12 pins), External ADC and Reference (9 pins)
GND: Power Supplies (31 pins), PCIe Cell Modem (39 pins), LoRa Concentrator (19 pins), TS-4900 Headers (29 pins), External ADC and Reference (19 pins)
PVin: Power Supplies (7 pins), External ADC and Reference (R55.2)
Vbat: Power Supplies (R37.2), TS-4900 Headers (J4.36)
4900RX_MODEMTX: PCIe Cell Modem (D9.2), TS-4900 Headers (J4.34)
4900TX_MODEMRX: PCIe Cell Modem (U1.15), TS-4900 Headers (R36.1)
~{ADC_CS}: TS-4900 Headers (R52.2), External ADC and Reference (U6.3)
ADC_SPI_MISO: TS-4900 Headers (J4.56), External ADC and Reference (R57.2)
ADC_SPI_MOSI: TS-4900 Headers (R53.1), External ADC and Reference (U6.2)
ADC_SPI_SLK: TS-4900 Headers (R54.1), External ADC and Reference (U6.1)
GPS_1PPS: LoRa Concentrator (J1.38), TS-4900 Headers (J4.99)
~{LORA_CS}: LoRa Concentrator (J1.68), TS-4900 Headers (R31.2)
LORA_RESET: LoRa Concentrator (J1.71), TS-4900 Headers (J4.98)
LORA_SPI_CLK: LoRa Concentrator (J1.66), TS-4900 Headers (R34.2)
LORA_SPI_MISO: LoRa Concentrator (R1.2), TS-4900 Headers (J5.69)
LORA_SPI_MOSI: LoRa Concentrator (J1.62), TS-4900 Headers (R33.2)
~{M_WAKE}: PCIe Cell Modem (J2.1 R8.1), TS-4900 Headers (J5.70)
M_USB_DN: PCIe Cell Modem (D4.2 J2.36), TS-4900 Headers (J5.29)
M_USB_DP: PCIe Cell Modem (D3.2 J2.38), TS-4900 Headers (J5.31)
MAIN_POWER_FAIL: Power Supplies (Q3.3 R27.1), TS-4900 Headers (J4.38)
MODEM_CTS: PCIe Cell Modem (R12.1), TS-4900 Headers (J4.28)
MODEM_DTR: PCIe Cell Modem (U1.18), TS-4900 Headers (R35.1)
MODEM_RESET: PCIe Cell Modem (Q1.1), TS-4900 Headers (J5.72)
MODEM_RI: PCIe Cell Modem (R9.1), TS-4900 Headers (J4.24)
MODEM_RTS: PCIe Cell Modem (U1.16), TS-4900 Headers (R32.1)